# EAGLE design fightboard-tester (EAGLE 9.6.2)
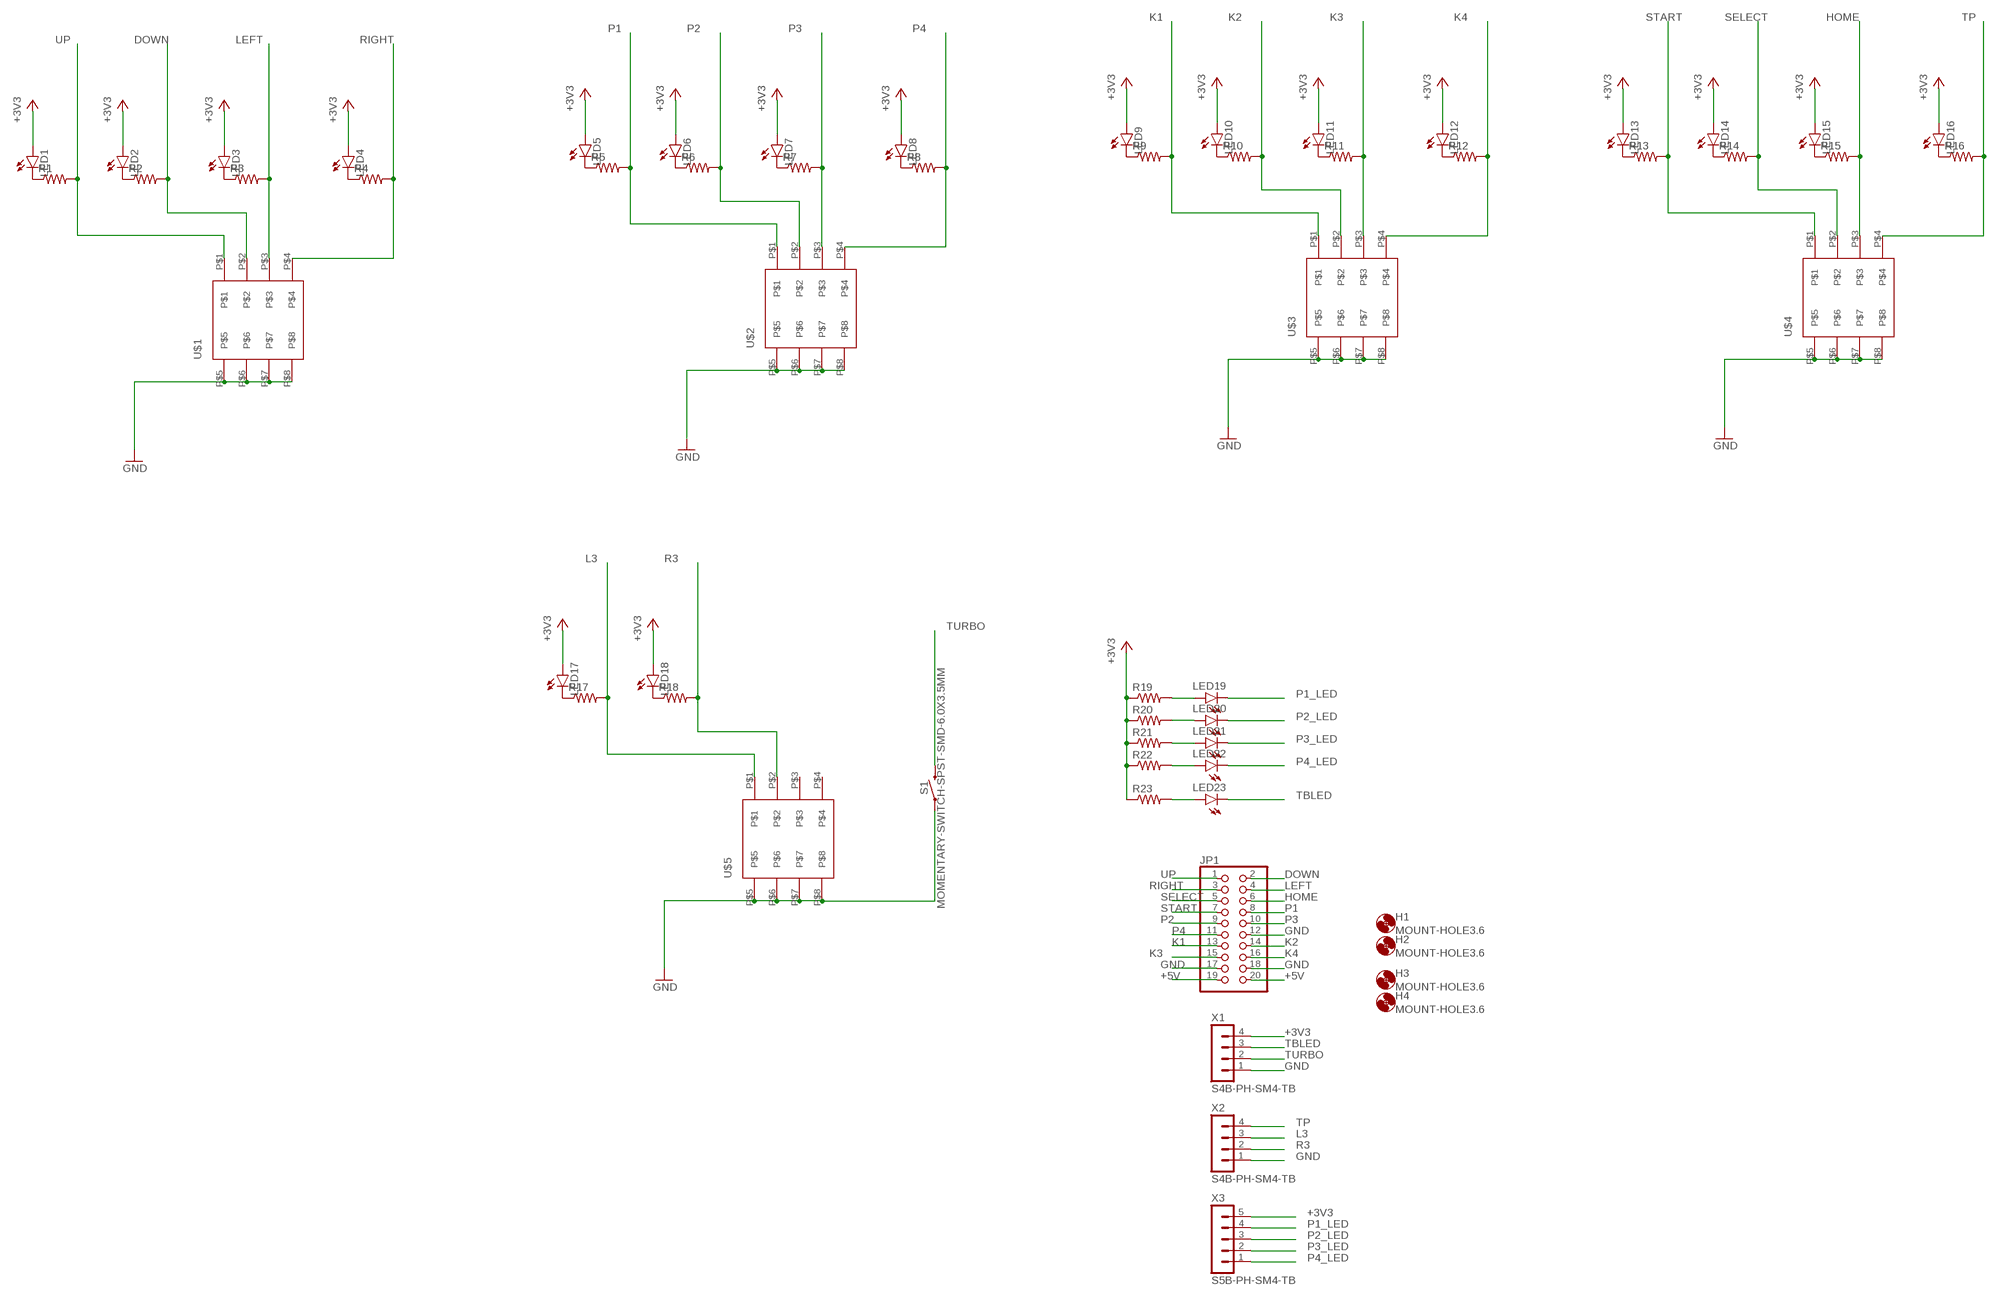
[diagram p0: schematic, sheet 1]

## Parts
H1  MOUNT-HOLE3.6  [3,6]
H2  MOUNT-HOLE3.6  [3,6]
H3  MOUNT-HOLE3.6  [3,6]
H4  MOUNT-HOLE3.6  [3,6]
JP1  PINHD-2X10  [2X10]
LED1  LEDCHIPLED_0805  [CHIPLED_0805]
LED2  LEDCHIPLED_0805  [CHIPLED_0805]
LED3  LEDCHIPLED_0805  [CHIPLED_0805]
LED4  LEDCHIPLED_0805  [CHIPLED_0805]
LED5  LEDCHIPLED_0805  [CHIPLED_0805]
LED6  LEDCHIPLED_0805  [CHIPLED_0805]
LED7  LEDCHIPLED_0805  [CHIPLED_0805]
LED8  LEDCHIPLED_0805  [CHIPLED_0805]
LED9  LEDCHIPLED_0805  [CHIPLED_0805]
LED10  LEDCHIPLED_0805  [CHIPLED_0805]
LED11  LEDCHIPLED_0805  [CHIPLED_0805]
LED12  LEDCHIPLED_0805  [CHIPLED_0805]
LED13  LEDCHIPLED_0805  [CHIPLED_0805]
LED14  LEDCHIPLED_0805  [CHIPLED_0805]
LED15  LEDCHIPLED_0805  [CHIPLED_0805]
LED16  LEDCHIPLED_0805  [CHIPLED_0805]
LED17  LEDCHIPLED_0805  [CHIPLED_0805]
LED18  LEDCHIPLED_0805  [CHIPLED_0805]
LED19  LEDCHIPLED_0805  [CHIPLED_0805]
LED20  LEDCHIPLED_0805  [CHIPLED_0805]
LED21  LEDCHIPLED_0805  [CHIPLED_0805]
LED22  LEDCHIPLED_0805  [CHIPLED_0805]
LED23  LEDCHIPLED_0805  [CHIPLED_0805]
R1  R-US_R0805  [R0805]
R2  R-US_R0805  [R0805]
R3  R-US_R0805  [R0805]
R4  R-US_R0805  [R0805]
R5  R-US_R0805  [R0805]
R6  R-US_R0805  [R0805]
R7  R-US_R0805  [R0805]
R8  R-US_R0805  [R0805]
R9  R-US_R0805  [R0805]
R10  R-US_R0805  [R0805]
R11  R-US_R0805  [R0805]
R12  R-US_R0805  [R0805]
R13  R-US_R0805  [R0805]
R14  R-US_R0805  [R0805]
R15  R-US_R0805  [R0805]
R16  R-US_R0805  [R0805]
R17  R-US_R0805  [R0805]
R18  R-US_R0805  [R0805]
R19  R-US_R0805  [R0805]
R20  R-US_R0805  [R0805]
R21  R-US_R0805  [R0805]
R22  R-US_R0805  [R0805]
R23  R-US_R0805  [R0805]
S1  MOMENTARY-SWITCH-SPST-SMD-6.0X3.5MM  [TACTILE_SWITCH_SMD_6.0X3.5MM]
U$1  DSIC04LS  [DSIC04LS]
U$2  DSIC04LS  [DSIC04LS]
U$3  DSIC04LS  [DSIC04LS]
U$4  DSIC04LS  [DSIC04LS]
U$5  DSIC04LS  [DSIC04LS]
X1  S4B-PH-SM4-TB  [S4B-PH-SM4-TB]
X2  S4B-PH-SM4-TB  [S4B-PH-SM4-TB]
X3  S5B-PH-SM4-TB  [S5B-PH-SM4-TB]

## Nets
+3V3: LED1.A LED2.A LED3.A LED4.A LED5.A LED6.A LED7.A LED8.A LED9.A LED10.A LED11.A LED12.A LED13.A LED14.A LED15.A LED16.A LED17.A LED18.A R19.1 R20.1 R21.1 R22.1 R23.1 X1.4 X3.5
+5V: JP1.19 JP1.20
DOWN: JP1.2 R2.2 U$1.P$2
GND: JP1.12 JP1.17 JP1.18 S1.1 U$1.P$5 U$1.P$6 U$1.P$7 U$1.P$8 U$2.P$5 U$2.P$6 U$2.P$7 U$2.P$8 U$3.P$5 U$3.P$6 U$3.P$7 U$3.P$8 U$4.P$5 U$4.P$6 U$4.P$7 U$4.P$8 U$5.P$5 U$5.P$6 U$5.P$7 U$5.P$8 X1.1 X2.1
HOME: JP1.6 R15.2 U$4.P$3
K1: JP1.13 R9.2 U$3.P$1
K2: JP1.14 R10.2 U$3.P$2
K3: JP1.15 R11.2 U$3.P$3
K4: JP1.16 R12.2 U$3.P$4
L3: R17.2 U$5.P$1 X2.3
LEFT: JP1.4 R3.2 U$1.P$3
N$1: LED5.C R5.1
N$2: LED6.C R6.1
N$3: LED7.C R7.1
N$4: LED8.C R8.1
N$5: LED1.C R1.1
N$6: LED2.C R2.1
N$7: LED3.C R3.1
N$8: LED4.C R4.1
N$9: LED9.C R9.1
N$10: LED10.C R10.1
N$11: LED11.C R11.1
N$12: LED12.C R12.1
N$13: LED13.C R13.1
N$14: LED14.C R14.1
N$15: LED15.C R15.1
N$16: LED16.C R16.1
N$17: LED17.C R17.1
N$18: LED18.C R18.1
N$19: LED19.A R19.2
N$20: LED20.A R20.2
N$21: LED21.A R21.2
N$22: LED22.A R22.2
N$23: LED23.A R23.2
P1: JP1.8 R5.2 U$2.P$1
P1_LED: LED19.C X3.4
P2: JP1.9 R6.2 U$2.P$2
P2_LED: LED20.C X3.3
P3: JP1.10 R7.2 U$2.P$3
P3_LED: LED21.C X3.2
P4: JP1.11 R8.2 U$2.P$4
P4_LED: LED22.C X3.1
R3: R18.2 U$5.P$2 X2.2
RIGHT: JP1.3 R4.2 U$1.P$4
SELECT: JP1.5 R14.2 U$4.P$2
START: JP1.7 R13.2 U$4.P$1
TBLED: LED23.C X1.3
TP: R16.2 U$4.P$4 X2.4
TURBO: S1.2 X1.2
UP: JP1.1 R1.2 U$1.P$1
Unconnected: U$5.P$3 U$5.P$4

## Library data of the parts
H1-H4 = holes:MOUNT-HOLE: MOUNTING HOLE with drill center marker
JP1 = pinhead:PINHD-2X10: PIN HEADER
LED1-LED23 = led:LED: LED OSRAM: - CHIPLED LG R971, LG N971, LY N971, LG Q971, LY Q971, LO R971, LY R971 LH N974, LH R974 LS Q976, LO Q976, LY Q976 LO Q996 - Hyper CHIPLED LW Q18S LB Q993, LB Q99A, LB R99A - SideLED LS A670, LO A670, LY A670, LG A670, LP A670 LB A673, LV A673, LT A673, LW A673 LH A674 LY A675 LS A676, LA A676, LO A676, LY A676, LW A676 LS A679, LY A679, LG A679 - Hyper Micro SIDELED® LS Y876, LA Y876, LO Y876, LY Y876 LT Y87S - SmartLED LW L88C, LW L88S LB L89C, LB L89S, LG L890 LS L89K, LO L89K, LY L89K LS L896, LA L896, LO L896, LY L896 - TOPLED LS T670, LO T670, LY T670, LG T670, LP T670 LSG T670, LSP T670, LSY T670, LOP T670, LYG T670 LG T671, LOG T671, LSG T671 LB T673, LV T673, LT T673, LW T673 LH T674 LS T676, LA T676, LO T676, LY T676, LB T676, LH T676, LSB T676, LW T676 LB T67C, LV T67C, LT T67C, LS T67K, LO T67K, LY T67K, LW E67C LS E67B, LA E67B, LO E67B, LY E67B, LB E67C, LV E67C, LT E67C LW T67C LS T679, LY T679, LG T679 LS T770, LO T770, LY T770, LG T770, LP T770 LB T773, LV T773, LT T773, LW T773 LH T774 LS E675, LA E675, LY E675, LS T675 LS T776, LA T776, LO T776, LY T776, LB T776 LHGB T686 LT T68C, LB T68C - Hyper Mini TOPLED® LB M676 - Mini TOPLED Santana® LG M470 LS M47K, LO M47K, LY M47K Source: http://www.osram.convergy.de LUXEON: - LUMILED® LXK2-PW12-R00, LXK2-PW12-S00, LXK2-PW14-U00, LXK2-PW14-V00 LXK2-PM12-R00, LXK2-PM12-S00, LXK2-PM14-U00 LXK2-PE12-Q00, LXK2-PE12-R00, LXK2-PE12-S00, LXK2-PE14-T00, LXK2-PE14-U00 LXK2-PB12-K00, LXK2-PB12-L00, LXK2-PB12-M00, LXK2-PB14-N00, LXK2-PB14-P00, LXK2-PB14-Q00 LXK2-PR12-L00, LXK2-PR12-M00, LXK2-PR14-Q00, LXK2-PR14-R00 LXK2-PD12-Q00, LXK2-PD12-R00, LXK2-PD12-S00 LXK2-PH12-R00, LXK2-PH12-S00 LXK2-PL12-P00, LXK2-PL12-Q00, LXK2-PL12-R00 Source: www.luxeon.com KINGBRIGHT: KA-3528ASYC Source: www.kingbright.com
R1-R23 = rcl:R-US_: RESISTOR, American symbol; SPICEPREFIX: R
S1 = 3Ded-SparkFun-Switches:MOMENTARY-SWITCH-SPST: Momentary Switch (Pushbutton) - SPST Normally-open (NO) SPST momentary switches (buttons, pushbuttons). Variants PTH-12MM - 12mm square, through-hole Momentary Pushbutton Switch - 12mm Square <https://www.sparkfun.com/products/9190> (COM-09190) PTH-6.0MM, PTH-6.0MM-KIT - 6.0mm square, through-hole Mini Pushbutton Switch <https://www.sparkfun.com/products/97> (COM-00097) KIT package intended for soldering kit's - only one side of pads' copper is exposed. PTH-RIGHT-ANGLE-KIT - Right-angle, through-hole Right Angle Tactile Button <https://www.sparkfun.com/products/10791> - Used on SparkFun BigTime Watch Kit <https://www.sparkfun.com/products/11734> SMD-12MM - 12mm square, surface-mount Tactile Button - SMD (12mm) <https://www.sparkfun.com/products/12993> (COM-12993) Used on SparkFun PicoBoard <https://www.sparkfun.com/products/11888> SMD-4.5MM - 4.5mm Square Trackball Switch Used on SparkFun Blackberry Trackballer Breakout <https://www.sparkfun.com/products/13169> SMD-4.6MMX2.8MM - 4.60mm x 2.80mm, surface mount Used on SparkFun SAMD21 Mini Breakout <https://www.sparkfun.com/products/13664> SMD-5.2MM, SMD-5.2-REDUNDANT - 5.2mm square, surface-mount Mini Pushbutton Switch - SMD <https://www.sparkfun.com/products/8720> (COM-08720) Used on Arduino Pro Mini <https://www.sparkfun.com/products/11114> REDUNDANT package connects both switch circuits together SMD-6.0X3.5MM - 6.0 x 3.5mm, surface mount Momentary Reset Switch SMD <https://www.sparkfun.com/products/8229> (COM-08229) SMD-6.2MM-TALL - 6.2mm square, surface mount Tactile Button - SMD (6mm) <https://www.sparkfun.com/products/12992> Used on SparkFun Digital Sandbox <https://www.sparkfun.com/products/12651> SMD-RIGHT-ANGLE - Right-angle, surface mount Used on SparkFun Block for Intel® Edison - Arduino <https://www.sparkfun.com/products/13036>; PROD_ID: SWCH-00815; SF_SKU: COM-08229
U$1-U$5 = XKB-Connect:DSIC04LS
X1 X2 = con-JST PH:S4B-PH: JST PH series header 2.00mm pitch disconnectable crimp style connectors, horizontal (side entry type), 4 pins
X3 = con-JST PH:S5B-PH: JST PH series header 2.00mm pitch disconnectable crimp style connectors, horizontal (side entry type), 5 pins

## Board
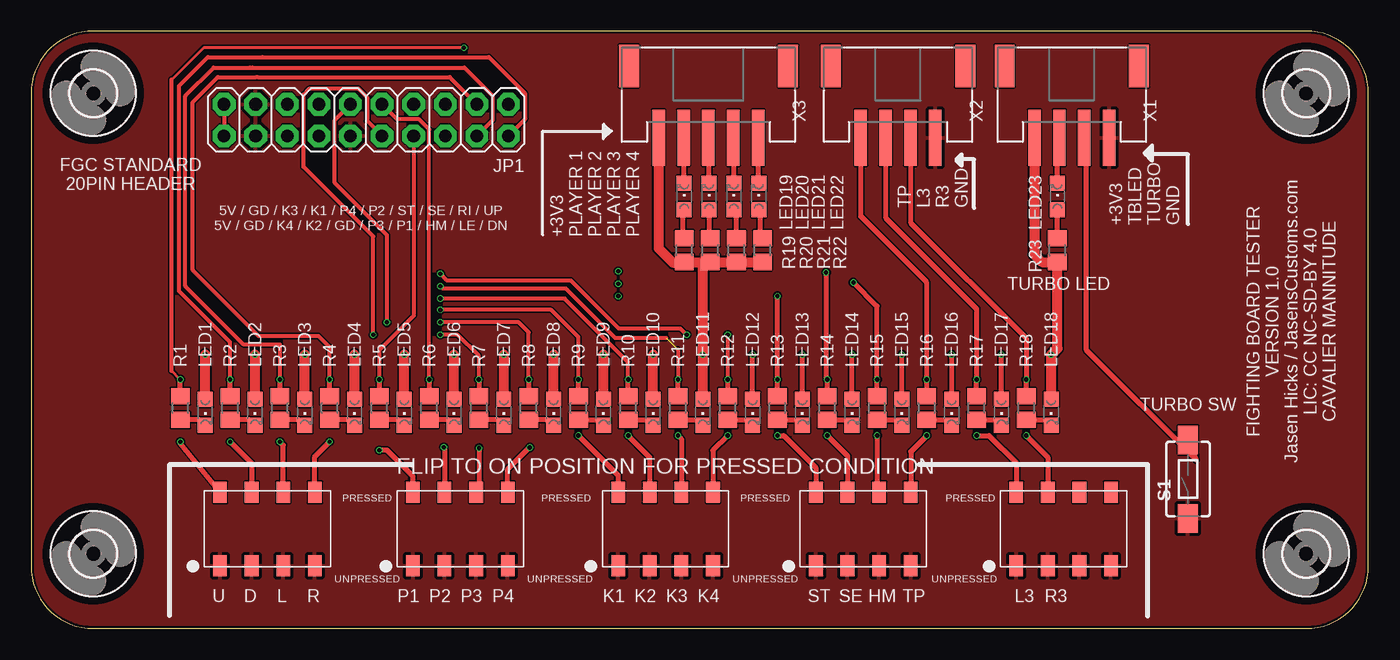
[diagram p1: board, top side]
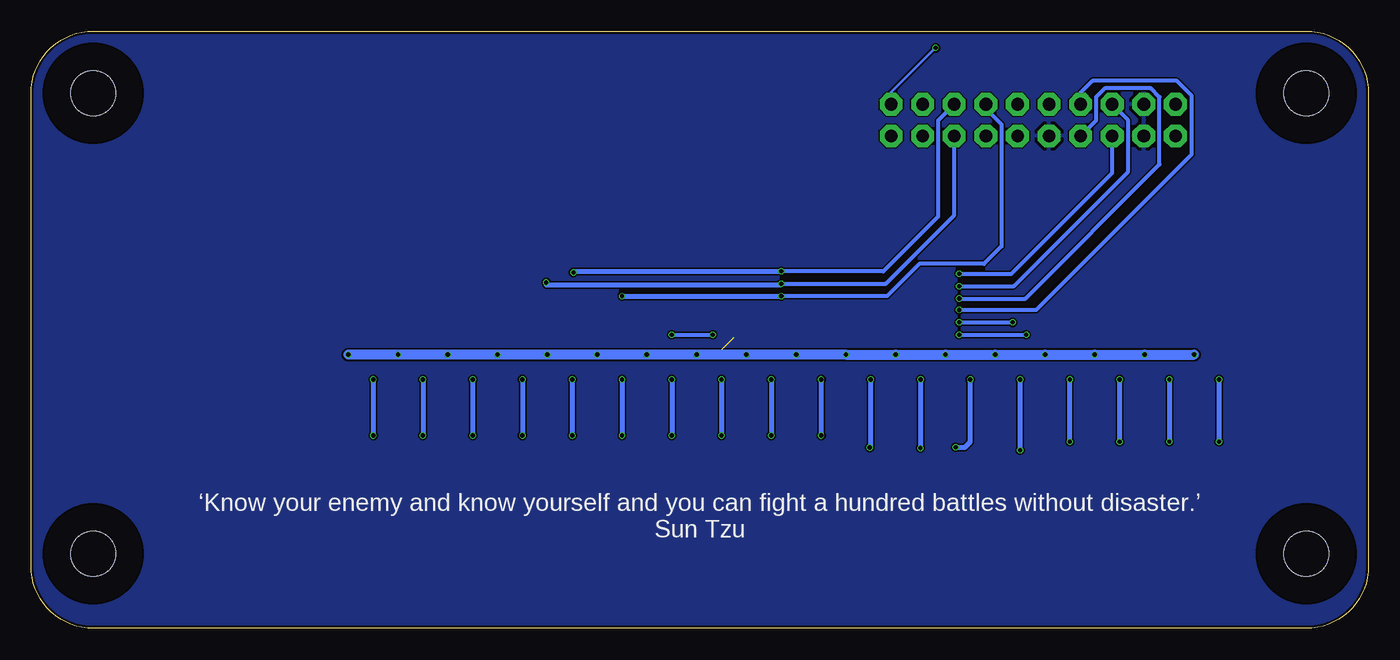
[diagram p2: board, bottom side, seen from below]

Size 107.5 x 48 mm. Coordinates in mm from the lower left corner, seen from the top.
Outline: 0,43 0,5 arc90 5,0 102.5,0 arc90 107.5,5 107.5,43 arc90 102.5,48 5,48 arc90 0,43
Copper layers (1*16): Top 0.035mm / dielectric 1.6mm / Bottom 0.035mm
Design rules "jlcpcb-2layers": minimum track width 5mil, minimum drill 0.3mm, track to track 5mil, track to pad 5mil, pad to pad 5mil, via to via 5mil, smd to smd 5mil, copper to edge 0.2mm, drill to drill 6mil, minimum pad ring 10mil, minimum via ring 3mil, stop-mask expansion 4mil, vias tented up to drill 0mil, thermal gap 10mil

### Footprints (pad centres in the part's own frame; a part is rotated, then mirrored left to right if it is on the bottom)
3,6 = hole 3.6: 0,0
2X10 = drill 1.016 octagon: 1 -11.43,-1.27; 2 -11.43,1.27; 3 -8.89,-1.27; 4 -8.89,1.27; 5 -6.35,-1.27; 6 -6.35,1.27; 7 -3.81,-1.27; 8 -3.81,1.27; 9 -1.27,-1.27; 10 -1.27,1.27; 11 1.27,-1.27; 12 1.27,1.27; 13 3.81,-1.27; 14 3.81,1.27; 15 6.35,-1.27; 16 6.35,1.27; 17 8.89,-1.27; 18 8.89,1.27; 19 11.43,-1.27; 20 11.43,1.27
CHIPLED_0805 = smd 1.2 x 1.2: A 0,-1.05; C 0,1.05
R0805 = smd 1.3 x 1.5: 1 -0.95,0; 2 0.95,0
TACTILE_SWITCH_SMD_6.0X3.5MM = smd 2.3 x 1.6: 1 -3.15,0; 2 3.15,0
DSIC04LS = smd 1.1 x 1.7: P$1 -3.81,2.95; P$2 -1.27,2.95; P$3 1.27,2.95; P$4 3.81,2.95; P$5 -3.81,-2.95; P$6 -1.27,-2.95; P$7 1.27,-2.95; P$8 3.81,-2.95
S4B-PH-SM4-TB = smd 1 x 4.5: 1 3,0; 2 1,0; 3 -1,0; 4 -3,0 | smd 1.6 x 3.4: M1 5.4,5.75; M2 -5.4,5.75
S5B-PH-SM4-TB = smd 1 x 4.5: 1 4,0; 2 2,0; 3 0,0; 4 -2,0; 5 -4,0 | smd 1.6 x 3.4: M1 6.4,5.75; M2 -6.4,5.75

### Placement (x,y rotation side)
H1  5,6 0 top
H2  5,43 0 top
H3  102.5,43 0 top
H4  102.5,6 0 top
JP1  26.94,40.85 180 top
LED1  14,17.36 180 top
LED2  18,17.36 180 top
LED3  22,17.36 180 top
LED4  26,17.36 180 top
LED5  30,17.36 180 top
LED6  34,17.36 180 top
LED7  38,17.36 180 top
LED8  42,17.36 180 top
LED9  46,17.36 180 top
LED10  50,17.36 180 top
LED11  54,17.36 180 top
LED12  58,17.36 180 top
LED13  62,17.36 180 top
LED14  66,17.36 180 top
LED15  70,17.36 180 top
LED16  74,17.36 180 top
LED17  78,17.36 180 top
LED18  82,17.36 180 top
LED19  52.5,34.71 0 top
LED20  54.5,34.71 0 top
LED21  56.5,34.71 0 top
LED22  58.5,34.71 0 top
LED23  82.5,34.71 0 top
R1  12,17.71 90 top
R2  16,17.71 90 top
R3  20,17.71 90 top
R4  24,17.71 90 top
R5  28,17.71 90 top
R6  32,17.71 90 top
R7  36,17.71 90 top
R8  40,17.71 90 top
R9  44,17.71 90 top
R10  48,17.71 90 top
R11  52,17.71 90 top
R12  56,17.71 90 top
R13  60,17.71 90 top
R14  64,17.71 90 top
R15  68,17.71 90 top
R16  72,17.71 90 top
R17  76,17.71 90 top
R18  80,17.71 90 top
R19  52.5,30.39 90 top
R20  54.6,30.39 90 top
R21  56.7,30.39 90 top
R22  58.8,30.39 90 top
R23  82.5,30.39 90 top
S1  93,12 90 top
U$1  19,8 0 top
U$2  34.5,8 0 top
U$3  51,8 0 top
U$4  66.9,8 0 top
U$5  83,8 0 top
X1  83.66,39.44 0 top
X2  69.69,39.44 0 top
X3  54.45,39.44 0 top

### Tracks (layer width: path | path; a pad name or v marks a point on that pad's centre or on a via)
+3V3  (via drill 0.35)
  Top 0.406: LED12.A v58,22 | LED13.A v62,22 | LED14.A v66,22 | LED15.A v70,22 | LED16.A v74,22 | LED17.A v78,22
  Top 0.813: LED5.A v30,22 | LED8.A v42,22 | LED1.A v14,22 | LED2.A v18,22 | LED4.A v26,22 | LED6.A v34,22 | LED7.A v38,22 | LED9.A v46,22 | LED10.A v50,22 | LED11.A v54,22 54,29.34 54.1,29.44 | X3.5 50.45,30.55 51.6,29.4 52.45,29.4 R19.1 54.1,29.44 | 54.1,29.44 R20.1 R21.1 R22.1 | LED3.A v22,22 | X1.4 80.66,30.04 81.25,29.44 R23.1 82.5,22.5 v82,22 LED18.A
  Bottom 0.813: v14,22 v18,22 v22,22 v26,22 v30,22 v34,22 v38,22 v42,22 v46,22 v50,22 v54,22 v58,22 v62,22 v66,22 v70,22 v74,22 v78,22 v82,22
+5V
  Top 0.305: JP1.19 JP1.20
DOWN  (via drill 0.35)
  Top 0.305: v16,20 16,23 11.9,27.1 11.9,43.6 14.2,45.9 18.6,45.9 36.8,45.9 39.7,43 39.7,40.91 JP1.2
  Top 0.406: R2.2 v16,20 | v16,15 17.73,13.27 U$1.P$2
  Bottom 0.406: v16,20 v16,15
GND
  pour Top: -1,-2.51 -1,47.2 0.8,49 106.4,49 109.3,46.1 109.3,-0.78 107.77,-2.31 -0.8,-2.31
  pour Bottom: -1.8,-0.47 -1.8,45.2 2.2,49.2 106.1,49.2 112.6,42.7 112.6,4.4 105.93,-2.27 0,-2.27
HOME  (via drill 0.35)
  Top 0.406: R15.2 v68,20 68,25.9 v66.1,27.8 | v68,15.5 68,11.12 U$4.P$3
  Bottom 0.305: v47.2,27.7 38.8,27.7 33.29,33.21 JP1.6
  Bottom 0.406: v68,20 v68,15.5 | v47.2,27.7 47.3,27.6 66.1,27.6 v66.1,27.8
K1  (via drill 0.35)
  Top 0.305: v44,20 44,23.4 41.8,25.6 v32.9,25.6
  Top 0.406: R9.2 v44,20 | v44,15.5 47.19,12.31 U$3.P$1
  Bottom 0.305: v32.9,25.6 26.7,25.6 14.2,38.1 14.2,42.8 15.4,44 22.2,44 23.13,43.07 JP1.13
  Bottom 0.406: v44,20 v44,15.5
K2  (via drill 0.35)
  Top 0.305: v48,20 48,21.4 42.89,26.51 v32.9,26.51
  Top 0.406: R10.2 v48,20 | v48,15.5 49.73,13.77 U$3.P$2
  Bottom 0.305: v32.9,26.51 27.59,26.51 16.8,37.3 16.8,42.7 17.5,43.4 21.2,43.4 21.9,42.7 21.9,40.81 JP1.14
  Bottom 0.406: v48,20 v48,15.5
K3  (via drill 0.35)  (1 unrouted)
  Top 0.305: 52,22.4 v52,20 | 51.05,23.35 46.95,23.35 43,27.3 33.1,27.3 v32.9,27.5
  Top 0.406: R11.2 v52,20 | v52,15.5 52.27,15.23 U$3.P$3
  Bottom 0.305: v32.9,27.5 28.5,27.5 19.3,36.7 19.3,40.83 JP1.15
  Bottom 0.406: v52,20 v52,15.5
K4  (via drill 0.35)
  Top 0.305: v56,20 v56,23.6 | v52.7,23.6 52.2,24.1 47.25,24.1 43.39,27.96 33.44,27.96 v32.9,28.5
  Top 0.406: R12.2 v56,20 | v56,15.5 54.81,14.31 U$3.P$4
  Bottom 0.305: v56,23.6 v52.7,23.6 | v32.9,28.5 28.7,28.5 20.59,36.61 JP1.16
  Bottom 0.406: v56,20 v56,15.5
L3  (via drill 0.35)
  Top 0.406: R17.2 v76,20 76,25.7 68.69,33.01 X2.3 | v76,15.5 77,15.5 79.19,13.31 U$5.P$1
  Bottom 0.406: v76,20 v76,15.5
LEFT  (via drill 0.35)
  Top 0.305: v20,20 20,22.8 17.1,22.8 12.4,27.5 12.4,42.8 14.67,45.07 17.6,45.07 17.8,45.07 34.83,45.07 37.1,42.8 37.1,40.85 JP1.4
  Top 0.406: R3.2 v20,20 | U$1.P$3 20.27,14.73 v20,15
  Bottom 0.406: v20,15 v20,20
N$1
  Top 0.406: LED5.C 29.55,16.76 R5.1
N$2
  Top 0.406: LED6.C 33.55,16.76 R6.1
N$3
  Top 0.406: LED7.C 37.55,16.76 R7.1
N$4
  Top 0.406: LED8.C 41.55,16.76 R8.1
N$5
  Top 0.406: LED1.C 13.55,16.76 R1.1
N$6
  Top 0.406: LED2.C 17.55,16.76 R2.1
N$7
  Top 0.406: LED3.C 21.55,16.76 R3.1
N$8
  Top 0.406: LED4.C 25.55,16.76 R4.1
N$9
  Top 0.406: R9.1 45.55,16.76 LED9.C
N$10
  Top 0.406: R10.1 49.55,16.76 LED10.C
N$11
  Top 0.406: R11.1 53.55,16.76 LED11.C
N$12
  Top 0.406: R12.1 57.55,16.76 LED12.C
N$13
  Top 0.406: R13.1 61.55,16.76 LED13.C
N$14
  Top 0.406: R14.1 65.55,16.76 LED14.C
N$15
  Top 0.406: R15.1 69.55,16.76 LED15.C
N$16
  Top 0.406: R16.1 73.55,16.76 LED16.C
N$17
  Top 0.406: R17.1 77.55,16.76 LED17.C
N$18
  Top 0.406: R18.1 81.55,16.76 LED18.C
N$19
  Top 0.406: LED19.A 52.4,33.76 52.4,31.44 R19.2
N$20
  Top 0.406: R20.2 54.5,31.44 LED20.A
N$21
  Top 0.406: R21.2 56.7,33.55 56.59,33.66 LED21.A
N$22
  Top 0.406: R22.2 58.6,31.55 58.6,33.55 58.5,33.64 LED22.A
N$23
  Top 0.406: R23.2 LED23.A
P1  (via drill 0.35)
  Top 0.305: JP1.8 30.75,25.13 28,22.38 v28,20
  Top 0.406: R5.2 v28,20 | U$2.P$1 30.69,12.23 28.6,14.32 v27.99,14.32
  Bottom 0.406: v27.99,14.32 v28,14.33 v28,20
P1_LED
  Top 0.406: X3.4 52.45,35.81 LED19.C
P2  (via drill 0.35)
  Top 0.305: JP1.9 29.43,40.9 31.2,40.9 32,40.1 v32,20
  Top 0.406: v33.17,14.56 33.23,14.5 U$2.P$2 | v32,20 R6.2
  Bottom 0.406: v33.17,14.56 32.44,14.56 32,15 v32,20
P2_LED
  Top 0.406: X3.3 54.45,35.81 LED20.C
P3  (via drill 0.35)
  Top 0.305: v36,20 36,21.9 34.3,23.6 v32.9,23.6 | v27.5,23.6 27.5,31.5 21.9,37.1 21.9,42.9 22.4,43.4 26.3,43.4 27,42.7 27,40.79 JP1.10
  Top 0.406: v36.01,14.49 36.01,11.19 U$2.P$3 | v36,20 R7.2
  Bottom 0.305: v32.9,23.6 v27.5,23.6
  Bottom 0.406: v36.01,14.49 v36,14.5 v36,20
P3_LED
  Top 0.406: X3.2 56.45,35.81 LED21.C
P4  (via drill 0.35)
  Top 0.305: v40,20 40,23.8 39.2,24.6 v32.9,24.6 | v28.6,24.6 28.6,31.6 24.4,35.8 24.4,40.85 JP1.11
  Top 0.406: v40,20 R8.2 | U$2.P$4 38.31,12.81 v40.08,14.55
  Bottom 0.305: v32.9,24.6 v28.6,24.6
  Bottom 0.406: v40.08,14.55 40,14.5 v40,20
P4_LED
  Top 0.406: X3.1 58.45,35.81 LED22.C
R3  (via drill 0.35)
  Top 0.406: R18.2 v80,20 80,23.3 70.69,32.61 X2.2 | v80,15.5 81.73,13.77 U$5.P$2
  Bottom 0.406: v80,20 v80,15.5
RIGHT  (via drill 0.35)
  Top 0.254: 18.1,44.3 18.2,44.3
  Top 0.305: v24,20 24,22.6 23.1,23.5 18.3,23.5 13,28.8 13,42.3 15,44.3 18.1,44.3 | 18.2,44.3 33.65,44.3 JP1.3
  Top 0.406: R4.2 v24,20 | U$1.P$4 22.81,13.81 v24,15
  Bottom 0.406: v24,15 v24,20
SELECT  (via drill 0.35)
  Top 0.406: R14.2 v64,20 63.9,20.1 v63.9,28.6 | v64,15.5 65.63,13.87 U$4.P$2
  Bottom 0.305: JP1.5 34.6,40.81 34.6,33.1 39,28.7 v47.2,28.7
  Bottom 0.406: v64,20 v64,15.5 | v63.9,28.6 63.8,28.7 v47.2,28.7
START  (via drill 0.35)
  Top 0.406: R13.2 v60,20 v60,26.7 | v60,15.5 60.5,15.5 63.09,12.91 U$4.P$1
  Bottom 0.305: JP1.7 30.75,41.75 29.5,40.5 29.5,30.7 30.9,29.3 36.1,29.3 38.7,26.7 v47.2,26.7
  Bottom 0.406: v60,20 v60,15.5 | v60,26.7 v47.2,26.7
TBLED
  Top 0.406: LED23.C 82.5,39.28 X1.3
TP  (via drill 0.35)
  Top 0.406: R16.2 v72,20 72,27.8 66.69,33.11 X2.4 | v72,15.5 70.71,14.21 U$4.P$4
  Bottom 0.406: v72,20 v72,15.5
TURBO
  Top 0.406: X1.2 84.8,39.3 84.8,22.4 93.65,13.55 S1.2
UP  (via drill 0.35)
  Top 0.254: v12,20 11.3,20.7 | v34.8,46.66 13.86,46.66 11.3,44.1
  Top 0.305: 11.3,20.7 11.3,44.1
  Top 0.406: R1.2 v12,20 | U$1.P$1 12,14.87 v12,15
  Bottom 0.254: v34.8,46.66 38.37,43.09 JP1.1
  Bottom 0.406: v12,15 v12,20

### Text on the board
tNames: FGC STANDARD / 20PIN HEADER | TP / L3 / R3 / GND | 5V / GD / K3 / K1 / P4 / P2 / ST / SE / RI / UP / 5V / GD / K4 / K2 / GD / P3 / P1 / HM / LE / DN | +3V3 / TBLED / TURBO / GND | +3V3 / PLAYER 1 / PLAYER 2 / PLAYER 3 / PLAYER 4 | TURBO LED | FIGHTING BOARD TESTER / VERSION 1.0 / Jasen Hicks / JasensCustoms.com / LIC: CC NC-SD-BY 4.0 / CAVALIER MANNITUDE | TURBO SW | FLIP TO ON POSITION FOR PRESSED CONDITION | PRESSED | PRESSED | PRESSED | PRESSED | UNPRESSED | UNPRESSED | UNPRESSED | UNPRESSED | U | D | L | R | P1 | P2 | P3 | P4 | K1 | K2 | K3 | K4 | ST | SE | HM | TP | L3 | R3
bNames: ‘Know your enemy and know yourself and you can fight a hundred battles without disaster.’ / Sun Tzu